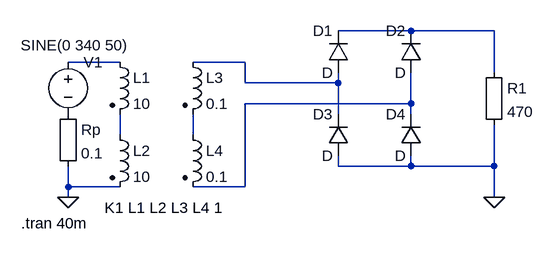
[diagram p0: schematic BridgeRectifier.asc]
BridgeRectifier.asc, the LTspice schematic file:
Version 4
SHEET 1 880 680
WIRE 464 -16 352 -16
WIRE 592 -16 464 -16
WIRE 16 32 -64 32
WIRE 208 32 128 32
WIRE 592 48 592 -16
WIRE 208 64 208 32
WIRE 352 64 352 48
WIRE 352 64 208 64
WIRE 464 96 464 48
WIRE 464 96 208 96
WIRE 352 112 352 64
WIRE 464 112 464 96
WIRE 16 144 16 112
WIRE 128 144 128 112
WIRE 352 192 352 176
WIRE 464 192 464 176
WIRE 464 192 352 192
WIRE 592 192 592 128
WIRE 592 192 464 192
WIRE -64 224 -64 192
WIRE 16 224 -64 224
WIRE 208 224 208 96
WIRE 208 224 128 224
WIRE -64 240 -64 224
WIRE 592 240 592 192
FLAG 592 240 0
FLAG -64 240 0
SYMBOL ind2 0 16 R0
SYMATTR InstName L1
SYMATTR Value 10
SYMATTR Type ind
SYMBOL ind2 0 128 R0
SYMATTR InstName L2
SYMATTR Value 10
SYMATTR Type ind
SYMBOL ind2 112 16 R0
SYMATTR InstName L3
SYMATTR Value 0.1
SYMATTR Type ind
SYMBOL ind2 112 128 R0
SYMATTR InstName L4
SYMATTR Value 0.1
SYMATTR Type ind
SYMBOL voltage -64 16 R0
WINDOW 3 -73 -10 Left 2
WINDOW 123 0 0 Left 2
WINDOW 39 0 0 Left 2
SYMATTR Value SINE(0 340 50)
SYMATTR InstName V1
SYMBOL Misc\\EuropeanResistor 576 32 R0
SYMATTR InstName R1
SYMATTR Value 470
SYMBOL Misc\\EuropeanResistor -80 96 R0
SYMATTR InstName Rp
SYMATTR Value 0.1
SYMBOL diode 368 48 R180
WINDOW 0 24 64 Left 2
WINDOW 3 24 0 Left 2
SYMATTR InstName D1
SYMBOL diode 480 48 R180
WINDOW 0 24 64 Left 2
WINDOW 3 24 0 Left 2
SYMATTR InstName D2
SYMBOL diode 368 176 R180
WINDOW 0 24 64 Left 2
WINDOW 3 24 0 Left 2
SYMATTR InstName D3
SYMBOL diode 480 176 R180
WINDOW 0 24 64 Left 2
WINDOW 3 24 0 Left 2
SYMATTR InstName D4
TEXT -8 256 Left 2 !K1 L1 L2 L3 L4 1
TEXT -136 280 Left 2 !.tran 40m

The netlist it stands for:
* BridgeRectifier.asc
L1 N002 N005 10
L2 N005 0 10
L3 N003 N006 0.1
L4 N006 N004 0.1
V1 N002 P001 SINE(0 340 50)
R1 N001 0 470
Rp P001 0 0.1
D1 N003 N001 D
D2 N004 N001 D
D3 0 N003 D
D4 0 N004 D
.model D D
.lib standard.dio
K1 L1 L2 L3 L4 1
.tran 40m
.backanno
.end